# EAGLE design buck (EAGLE 9.5.1)
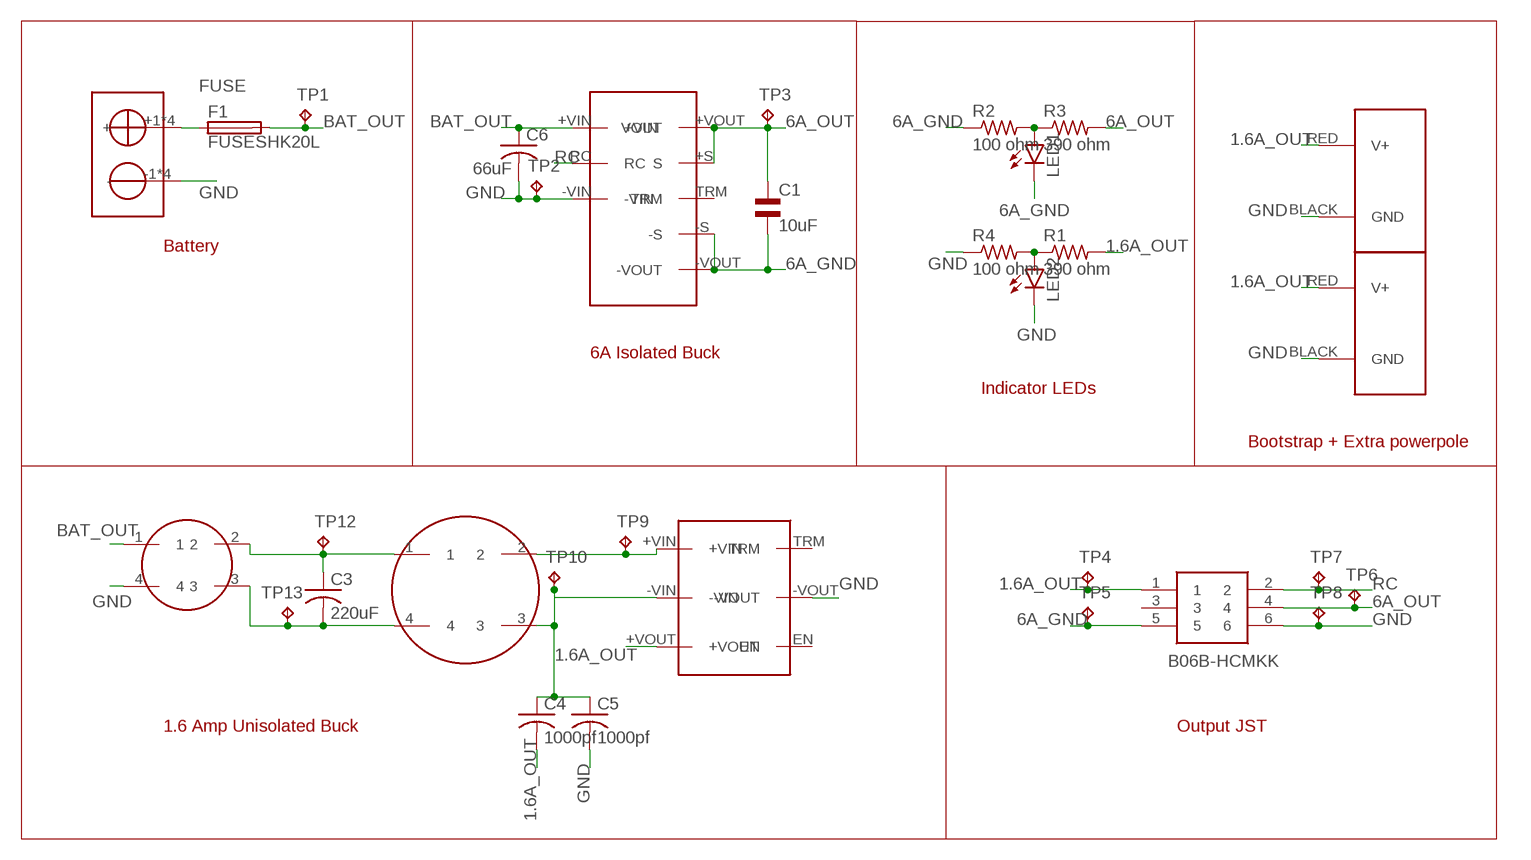
[diagram p0: schematic, sheet 1]

## Parts
BUCK150UH  CMNMODECHOKE150UH  [CMNMODECHOKE150UH]
C1  10uF  EL-BI25-10AXIAL  [EU25-10]
C3  220uF  C-USC0805  [C0805]
C4  1000pf  C-USC0805  [C0805]
C5  1000pf  C-USC0805  [C0805]
C6  66uF  C-USC0805  [C0805]
CHOKEME  CMNMODECHOKE1.2MH  [CMNMODECHOKE1.2MH]
F1  FUSESHK20L  [SHK20L]
J1  B06B-HCMKK  [B06BHCMKK]
J2  POWERPOLE_POWER45A_DRILL  [POWERPOLE_PAIR_45A_HOLE]
J3  POWERPOLE_POWER45A_DRILL  [POWERPOLE_PAIR_45A_HOLE]
LED1  LEDCHIP-LED0603  [CHIP-LED0603]
LED2  LEDCHIP-LED0603  [CHIP-LED0603]
R1  390 ohm  R-US_R0805  [R0805]
R2  100 ohm  R-US_R0805  [R0805]
R3  390 ohm  R-US_R0805  [R0805]
R4  100 ohm  R-US_R0805  [R0805]
TP1  TPPAD1-13  [P1-13]
TP2  TPPAD1-13  [P1-13]
TP3  TPPAD1-13  [P1-13]
TP4  TPPAD1-13  [P1-13]
TP5  TPPAD1-13  [P1-13]
TP6  TPPAD1-13  [P1-13]
TP7  TPPAD1-13  [P1-13]
TP8  TPPAD1-13  [P1-13]
TP9  TPPAD1-13  [P1-13]
TP10  TPPAD1-13  [P1-13]
TP12  TPPAD1-13  [P1-13]
TP13  TPPAD1-13  [P1-13]
U$1  12V6ABUCKCONVERTER  [12V6ABUCKCONVERTER]
U$2  SB50  [MINI-SB-50]
U$3  BUCK1.6A  [BUCK1.6A]

## Nets
1.6A_OUT: C4.2 J1.1 J2.RED(V+) J3.RED(V+) R1.2 TP4.TP U$3.+VOUT
6A_GND [Power]: C1.2 J1.5 LED1.C R2.1 TP5.TP U$1.-S U$1.-VOUT
6A_OUT [Power]: C1.1 J1.4 R3.2 TP3.TP TP6.TP U$1.+S(S) U$1.+VOUT(VOUT)
BAT_OUT [Power]: BUCK150UH.1 C6.1 F1.2A TP1.TP U$1.+VIN
FUSE [Power]: F1.1A U$2.+1(+) U$2.+2(+) U$2.+3(+) U$2.+4(+)
GND [Power]: BUCK150UH.4 C5.2 C6.2 J1.6 J2.BLACK(GND) J3.BLACK(GND) LED2.C R4.1 TP2.TP TP8.TP U$1.-VIN U$2.-1(-) U$2.-2(-) U$2.-3(-) U$2.-4(-) U$3.-VOUT
N$3: BUCK150UH.2 C3.1 CHOKEME.1 TP12.TP
N$4: BUCK150UH.3 C3.2 CHOKEME.4 TP13.TP
N$6: CHOKEME.2 TP9.TP U$3.+VIN
N$8: C4.1 C5.1 CHOKEME.3 TP10.TP U$3.-VIN
N$10 [Power]: LED2.A R1.1 R4.2
N$24 [Power]: LED1.A R2.2 R3.1
RC: J1.2 TP7.TP U$1.RC
Unconnected: J1.3 U$1.TRM U$3.EN U$3.TRM

## Notes on the sheet
- Battery
- 6A Isolated Buck
- Indicator LEDs
- Bootstrap + Extra powerpole
- 1.6 Amp Unisolated Buck | Output JST

## Library data of the parts
BUCK150UH = cmnModeChoke150uH:CMNMODECHOKE150UH
C1 = rcl:EL-: BIPOLAR ELECTROLYTIC CAPACITOR; SPICEPREFIX: C
C3-C6 = rcl:C-US: CAPACITOR, American symbol; SPICEPREFIX: C
CHOKEME = cmnModeChoke1.2mH:CMNMODECHOKE1.2MH
F1 = fuse:FUSE: Fuse; OC_FARNELL: unknown; OC_NEWARK: unknown
J1 = B06B-HCMKK:B06B-HCMKK: Automotive Connectors 6P AIT Header Top Position (BLK) Source: Datasheet <https://componentsearchengine.com/Datasheets/1/B06B-HCMKK.pdf>; DESCRIPTION: Automotive Connectors 6P AIT Header Top Position (BLK); HEIGHT: 13.7mm; MANUFACTURER_NAME: JST (JAPAN SOLDERLESS TERMINALS); MANUFACTURER_PART_NUMBER: B06B-HCMKK; MOUSER_PART_NUMBER: 306-B06B-HCMKK; MOUSER_PRICE-STOCK: https://www.mouser.com/Search/Refine.aspx?Keyword=306-B06B-HCMKK
J2 J3 = powerpoles:POWERPOLE_POWER: Anderson Powerpole Power Connector using ameteur radio standard layout
LED1 LED2 = led:LED: LED OSRAM: - CHIPLED LG R971, LG N971, LY N971, LG Q971, LY Q971, LO R971, LY R971 LH N974, LH R974 LS Q976, LO Q976, LY Q976 LO Q996 - Hyper CHIPLED LW Q18S LB Q993, LB Q99A, LB R99A - SideLED LS A670, LO A670, LY A670, LG A670, LP A670 LB A673, LV A673, LT A673, LW A673 LH A674 LY A675 LS A676, LA A676, LO A676, LY A676, LW A676 LS A679, LY A679, LG A679 - Hyper Micro SIDELED® LS Y876, LA Y876, LO Y876, LY Y876 LT Y87S - SmartLED LW L88C, LW L88S LB L89C, LB L89S, LG L890 LS L89K, LO L89K, LY L89K LS L896, LA L896, LO L896, LY L896 - TOPLED LS T670, LO T670, LY T670, LG T670, LP T670 LSG T670, LSP T670, LSY T670, LOP T670, LYG T670 LG T671, LOG T671, LSG T671 LB T673, LV T673, LT T673, LW T673 LH T674 LS T676, LA T676, LO T676, LY T676, LB T676, LH T676, LSB T676, LW T676 LB T67C, LV T67C, LT T67C, LS T67K, LO T67K, LY T67K, LW E67C LS E67B, LA E67B, LO E67B, LY E67B, LB E67C, LV E67C, LT E67C LW T67C LS T679, LY T679, LG T679 LS T770, LO T770, LY T770, LG T770, LP T770 LB T773, LV T773, LT T773, LW T773 LH T774 LS E675, LA E675, LY E675, LS T675 LS T776, LA T776, LO T776, LY T776, LB T776 LHGB T686 LT T68C, LB T68C - Hyper Mini TOPLED® LB M676 - Mini TOPLED Santana® LG M470 LS M47K, LO M47K, LY M47K Source: http://www.osram.convergy.de LUXEON: - LUMILED® LXK2-PW12-R00, LXK2-PW12-S00, LXK2-PW14-U00, LXK2-PW14-V00 LXK2-PM12-R00, LXK2-PM12-S00, LXK2-PM14-U00 LXK2-PE12-Q00, LXK2-PE12-R00, LXK2-PE12-S00, LXK2-PE14-T00, LXK2-PE14-U00 LXK2-PB12-K00, LXK2-PB12-L00, LXK2-PB12-M00, LXK2-PB14-N00, LXK2-PB14-P00, LXK2-PB14-Q00 LXK2-PR12-L00, LXK2-PR12-M00, LXK2-PR14-Q00, LXK2-PR14-R00 LXK2-PD12-Q00, LXK2-PD12-R00, LXK2-PD12-S00 LXK2-PH12-R00, LXK2-PH12-S00 LXK2-PL12-P00, LXK2-PL12-Q00, LXK2-PL12-R00 Source: www.luxeon.com KINGBRIGHT: KA-3528ASYC Source: www.kingbright.com
R1-R4 = rcl:R-US_: RESISTOR, American symbol; SPICEPREFIX: R
TP1-TP10 TP12 TP13 = testpad:TP: Test pad
U$1 = 12v6aBuckConverter:12V6ABUCKCONVERTER
U$2 = REV BLDC:SB50
U$3 = buck_1.6:BUCK1.6A

## Net classes
0 default: width 0.762 mm
1 Power: width 1.524 mm

## Board
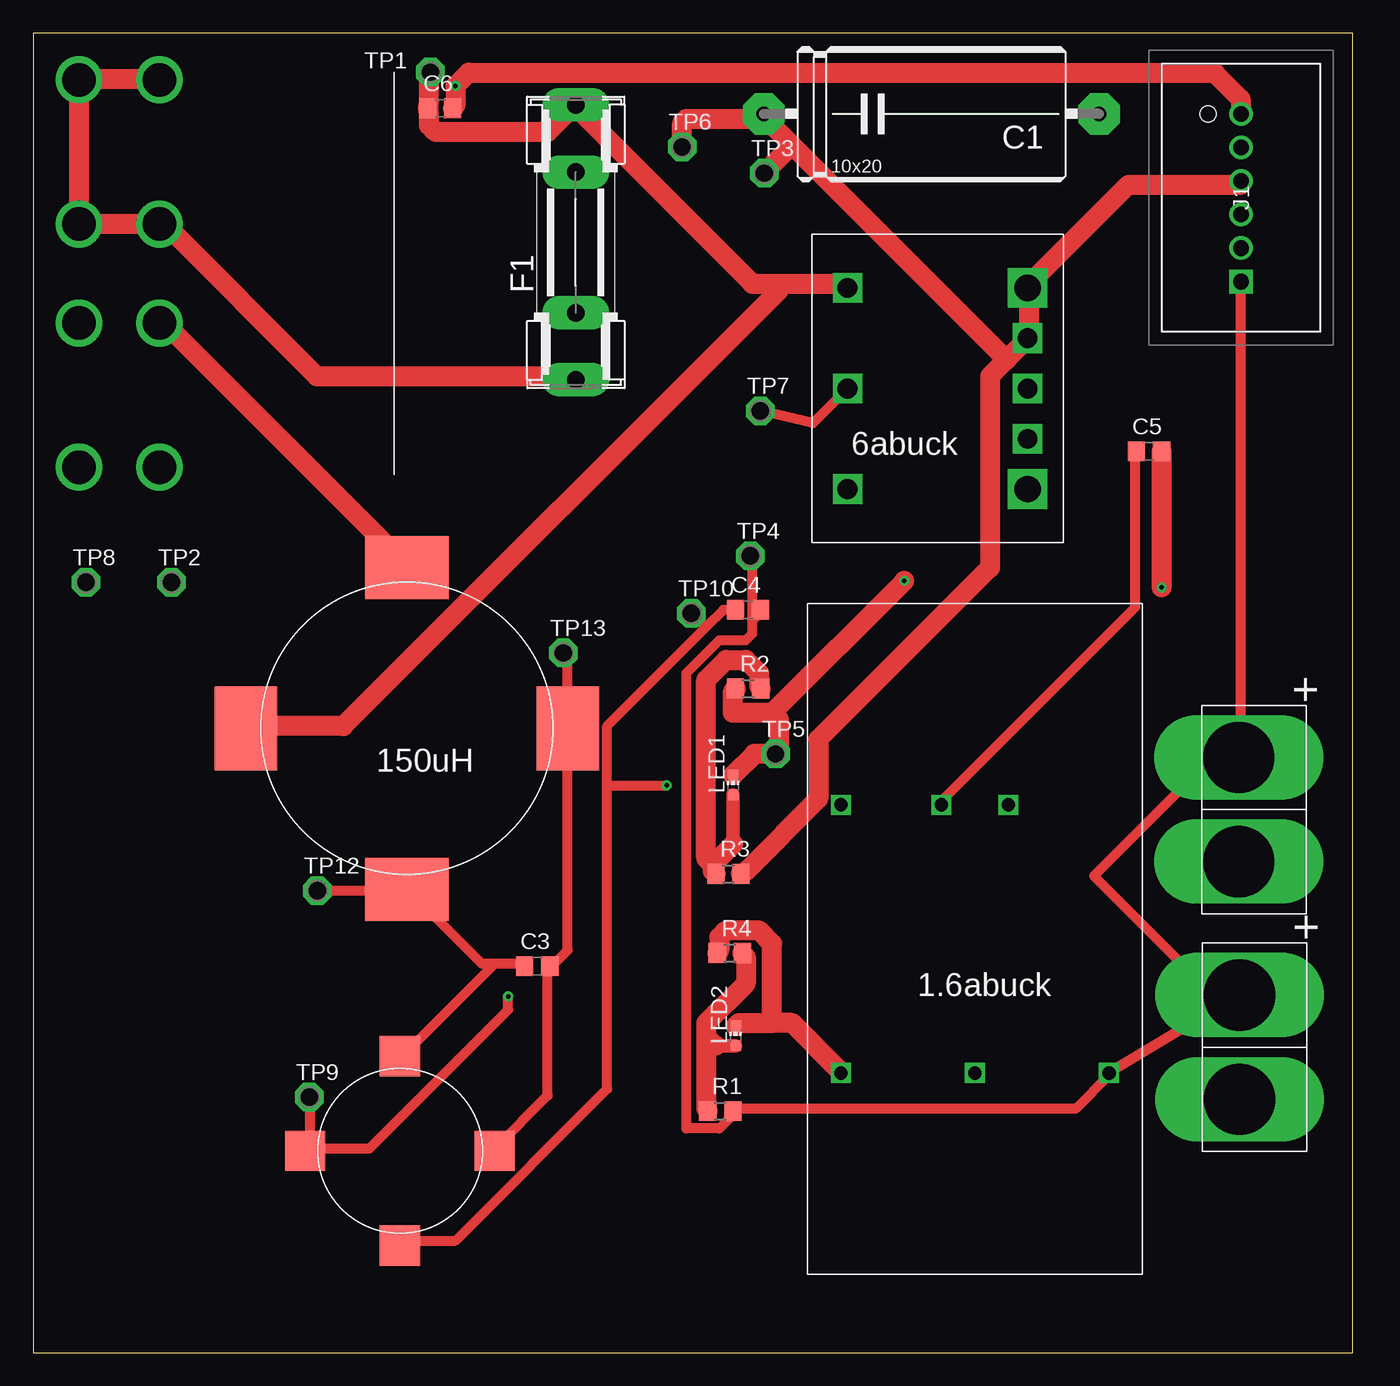
[diagram p1: board, top side]
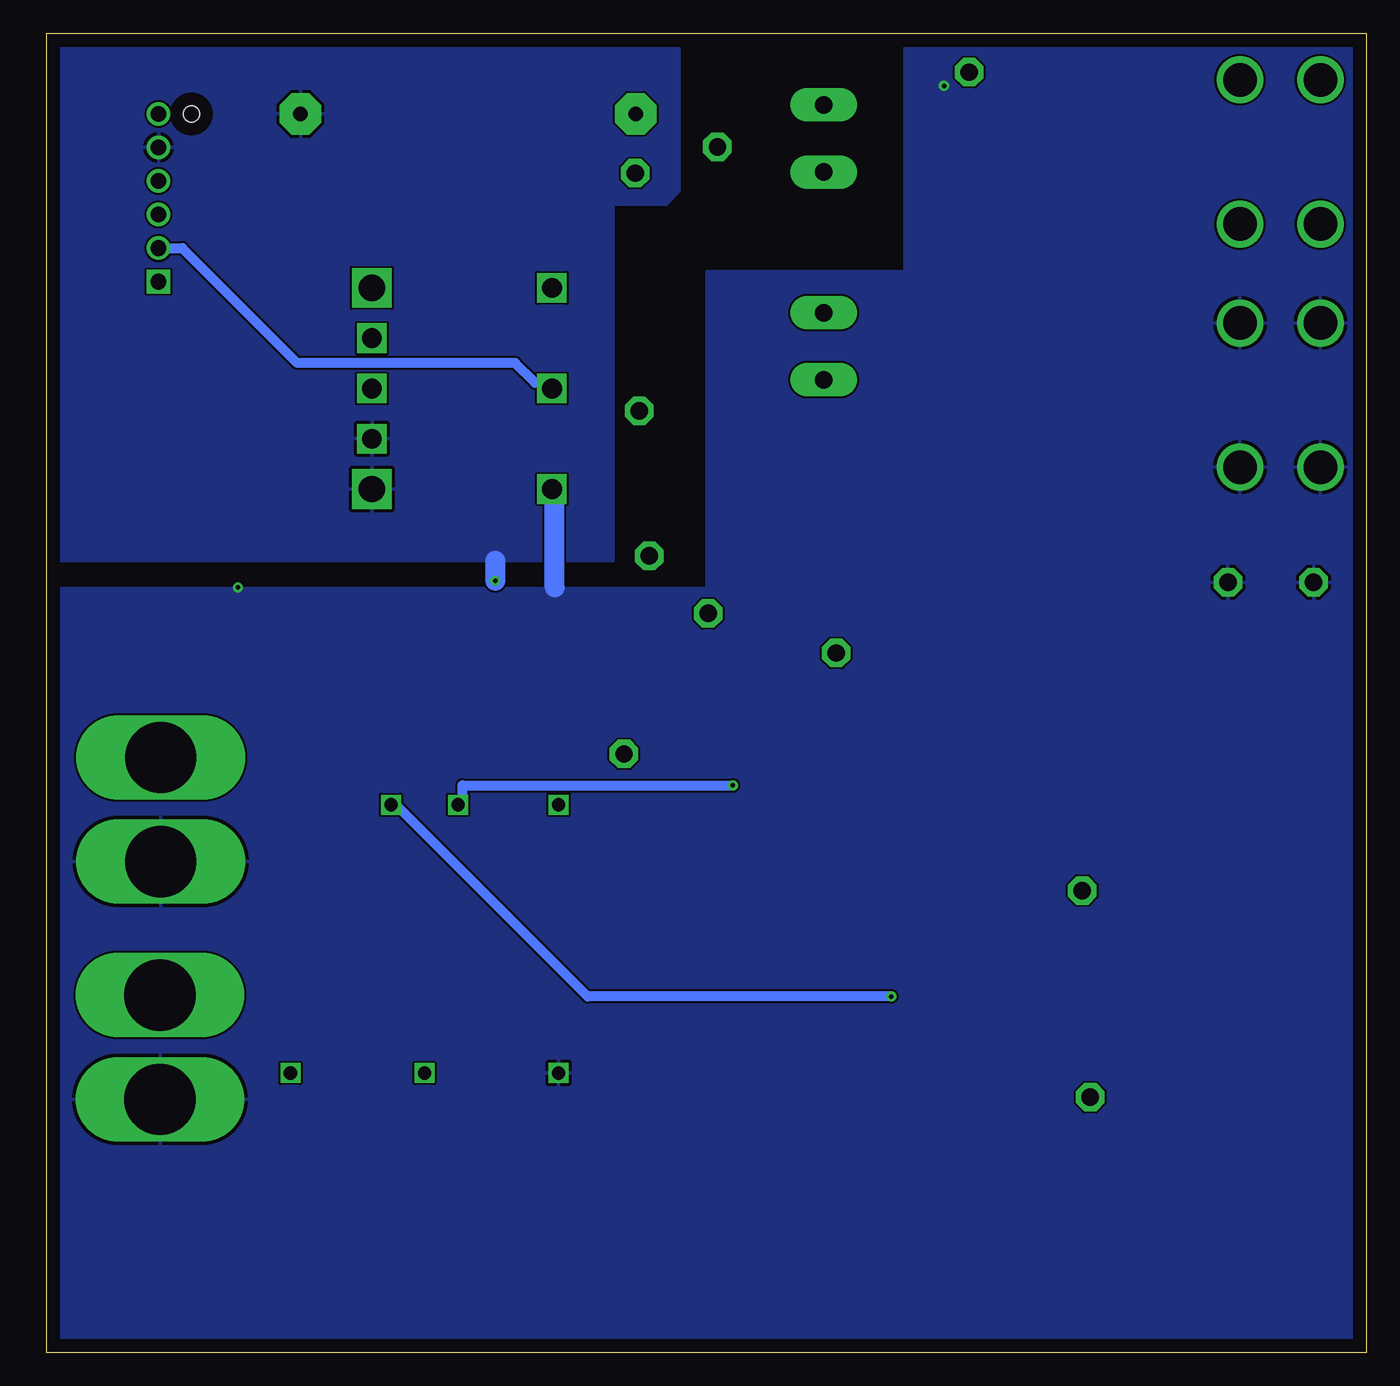
[diagram p2: board, bottom side, seen from below]

Size 100 x 100 mm. Coordinates in mm from the lower left corner, seen from the top.
Outline: 0,0 100,0 100,100 0,100 0,0
Copper layers (1*16): Top 0.035mm / dielectric 1.5mm / Bottom 0.035mm
Design rules "default": minimum track width 6mil, minimum drill 0.35mm, track to track 6mil, track to pad 6mil, pad to pad 6mil, via to via 6mil, smd to smd 6mil, copper to edge 40mil, drill to drill 6mil, minimum pad ring 10mil, minimum via ring 8mil, stop-mask expansion 4mil, vias tented up to drill 0mil, thermal gap 10mil

### Footprints (pad centres in the part's own frame; a part is rotated, then mirrored left to right if it is on the bottom)
CMNMODECHOKE150UH = smd 4.763 x 6.35: 1 -12.192,0; 3 12.192,0 | smd 6.35 x 4.763: 2 0,-12.192; 4 0,12.192
EU25-10 = drill 1.118 pad 3.15 octagon: 1 -12.7,0; 2 12.7,0
C0805 = smd 1.3 x 1.5: 1 -0.95,0; 2 0.95,0
CMNMODECHOKE1.2MH = smd 3.048 x 3.048: 1 0,7.176; 2 -7.176,0; 3 0,-7.176; 4 7.176,0
SHK20L = drill 1.321 pad 2.54 long: 1A -10.414,0; 1B -5.334,0; 2A 10.414,0; 2B 5.334,0
B06BHCMKK = drill 1.2 pad 1.8 square: 1 0,0 | drill 1.2 pad 1.8: 2 2.54,0; 3 5.08,0; 4 7.62,0; 5 10.16,0; 6 12.7,0 | hole 1.2: 12.7,2.5
POWERPOLE_PAIR_45A_HOLE = drill 5.4 long: BLACK 3.95,-1.15; RED -3.95,-1.15
CHIP-LED0603 = smd 0.8 x 0.8: A 0,-0.75; C 0,0.75
R0805 = smd 1.3 x 1.5: 1 -0.95,0; 2 0.95,0
P1-13 = drill 1.321 pad 2.159 octagon: TP 0,0
12V6ABUCKCONVERTER = drill 1.5 square: +S 6.82,3.81; +VIN -6.82,7.62; -S 6.82,-3.81; -VIN -6.82,-7.62; RC -6.82,0; TRM 6.82,0 | drill 2 square: +VOUT 6.82,7.62; -VOUT 6.82,-7.62
MINI-SB-50 = drill 2.54: +1 -6.096,14.668; +2 0,14.668; +3 -6.096,3.747; +4 0,3.747; -1 -6.096,-3.747; -2 0,-3.747; -3 -6.096,-14.668; -4 0,-14.668
BUCK1.6A = drill 1 square: +VIN 2.54,10.16; +VOUT 10.16,-10.16; -VIN -2.54,10.16; -VOUT -10.16,-10.16; EN -10.16,10.16; TRM 0,-10.16

### Placement (x,y rotation side)
BUCK150UH  28.32,47.32 0 top
C1  68.06,93.87 0 top
C3  38.2,29.3 0 top
C4  54.17,56.3 0 top
C5  84.55,68.3 0 top
C6  30.85,94.3 0 top
CHOKEME  27.8,15.32 0 top
F1  41.12,84.14 90 top
J1  91.52,81.17 90 top
J2  92.55,23.17 270 top
J3  92.5,41.17 270 top
LED1  53.04,43.03 0 top
LED2  53.23,24.03 0 top
R1  52.07,18.33 0 top
R2  54.18,50.33 0 top
R3  52.68,36.3 0 top
R4  52.79,30.3 0 top
TP1  30.1,97.03 0 top
TP2  10.49,58.38 0 top
TP3  55.41,89.38 0 top
TP4  54.33,60.38 0 top
TP5  56.25,45.38 0 top
TP6  49.17,91.38 0 top
TP7  55.09,71.38 0 top
TP8  4.01,58.38 0 top
TP9  20.93,19.38 0 top
TP10  49.88,56.03 0 top
TP12  21.53,35.03 0 top
TP13  40.18,53.03 0 top
U$1  68.53,73.07 0 top
U$2  9.58,81.78 0 top
U$3  71.36,31.37 0 top

### Tracks (layer width: path | path; a pad name or v marks a point on that pad's centre or on a via)
1.6A_OUT
  Top 0.381: 91.5,81 J1.1 | 53.5,18.5 R1.2 53,18 | 81.52,21.02 U$3.+VOUT | J2.RED 91.36,27.16 91.34,27.14 | 54.5,60 TP4.TP
  Top 0.762: 91.5,81 91.5,45.5 J3.RED 89.35,45.12 80.38,36.15 89.4,27.12 J2.RED | 53.5,18.5 79,18.5 81.52,21.02 | 54.5,55.5 55,56 C4.2 | 53,18 52,17 49.5,17 49.5,51.5 52,54 54,54 54.5,54.5 54.5,55.5 | 91.34,27.14 U$3.+VOUT | 54.5,55.5 54.5,60
6A_GND  (via drill 0.35)
  Top 1.524: R2.1 53,50 53,48.5 56,48.5 | v66,58.5 56,48.5 | 56,48.5 56.5,48 56.5,45.5 TP5.TP 54.64,45.38 LED1.C
  Bottom 1.524: 66,60 v66,58.5
  pour Bottom: 104,101 104,62 102,60 57,60 57,87 53,87 52,88 52,104 54,106 104,106
6A_OUT
  Top 1.524: J1.4 91.5,88.5 83,88.5 75.5,81 U$1.+VOUT 75.5,80 75.5,77.5 U$1.+S 75,76.5 73.75,75.25 | 73.75,75.25 72.5,74 72.5,59.5 59.5,46.5 59.5,42 54,36.5 R3.2 | 73.75,75.25 57.5,91.5 | 57.5,91.5 55.5,93.5 C1.1 55,93.5 49.5,93.5 49.17,93.17 TP6.TP | 57.5,91.5 55.5,89.5 TP3.TP
BAT_OUT
  Top 1.524: 56.5,81 54.5,81 41.5,94 F1.2A 41,94.5 39,92.5 30.5,92.5 30,93 30,94 C6.1 30,95 30,97 TP1.TP | 56.5,81 61.5,81 U$1.+VIN | BUCK150UH.1 16.5,47.5 23.5,47.5 56.5,80.5 56.5,81
FUSE
  Top 1.524: U$2.+2 9.5,96.5 3.5,96.5 U$2.+1 3.5,96 3.5,86 U$2.+3 3.5,85.5 9,85.5 U$2.+4 10,85.5 21.5,74 41,74 F1.1A
GND  (via drill 0.35)
  Top 1.524: 56,25 57.5,25 61,21.5 U$3.-VOUT | C6.2 32,94.5 v32,96 33,97 89.5,97 91.5,95 91.5,94 J1.6 | 56,25 56,31 55,32 52.5,32 52,31.5 52,30.5 R4.1 | v85.5,58 C5.2 | BUCK150UH.4 28,60 10,78 U$2.-2 | LED2.C 53.45,25 56,25
  Bottom 1.524: 61.5,58 61.5,65 U$1.-VIN
  pour Bottom: 50,82 35,82 35,104 -3,104 -7,100 -7,-12 108,-12 107,-11 107,58 50,58
N$3
  Top 0.381: 28.5,35 BUCK150UH.2 | 28,22.5 CHOKEME.1 | 22,35 TP12.TP
  Top 0.762: 35,29.5 34,29.5 28.5,35 | 35,29.5 37,29.5 C3.1 | 35,29.5 28,22.5 | 22,35 28,35 BUCK150UH.2
N$4
  Top 0.381: 35,15.5 CHOKEME.4 | 40.5,47 BUCK150UH.3 40.5,47.5
  Top 0.762: 35,15.5 39,19.5 39,29 C3.2 39.5,29.5 40.5,30.5 40.5,47 | 40.5,47.5 40.5,53 TP13.TP
N$6  (via drill 0.35)
  Top 0.381: 21,19 TP9.TP | 21,15.5 CHOKEME.2
  Top 0.762: v36,27 36,26 25.5,15.5 21,15.5 21,19
  Bottom 0.381: 73.5,41.5 U$3.+VIN
  Bottom 0.762: 73.5,41.5 59,27 v36,27
N$8  (via drill 0.35)
  Top 0.381: 83.5,68 C5.1 | 28,8.5 CHOKEME.3 | 50,56 TP10.TP
  Top 0.762: 83.5,68 83.5,56.5 69,42 U$3.-VIN | 51,55 43.5,47.5 43.5,43 | C4.1 52.3,56.3 51,55 | 43.5,43 43.5,20 32,8.5 28,8.5 | 43.5,43 v48,43 | 51,55 50,56
  Bottom 0.762: v48,43 68.5,43 68.5,42 U$3.-VIN
N$10
  Top 1.016: LED2.A 51.72,23.28
  Top 1.524: R1.1 51,18.5 51,24 | R4.2 54,30 54,28 51,25 51,24 | 51.72,23.28 51,24
N$24
  Top 1.016: LED1.A 53.04,38.54
  Top 1.524: 51.5,37 51.5,36.5 R3.1 | R2.2 55,50.5 55,51.5 54,52.5 52.5,52.5 51,51 51,37.5 51.5,37 | 53.04,38.54 51.5,37
RC
  Top 0.762: U$1.RC 59.08,70.44 TP7.TP
  Bottom 0.381: 63,73.5 62,73.5 U$1.RC
  Bottom 0.762: J1.2 89.71,83.71 81,75 64.5,75 63,73.5

### Text on the board
tNames: 6abuck | 150uH | 1.6abuck